# EasyEDA schematic SCH_Tanbre_v2_latest.json
TITLE: Tanbre; REV: 2.0; Date: 2026-05-30; Sheet: 1/1; Company: Student
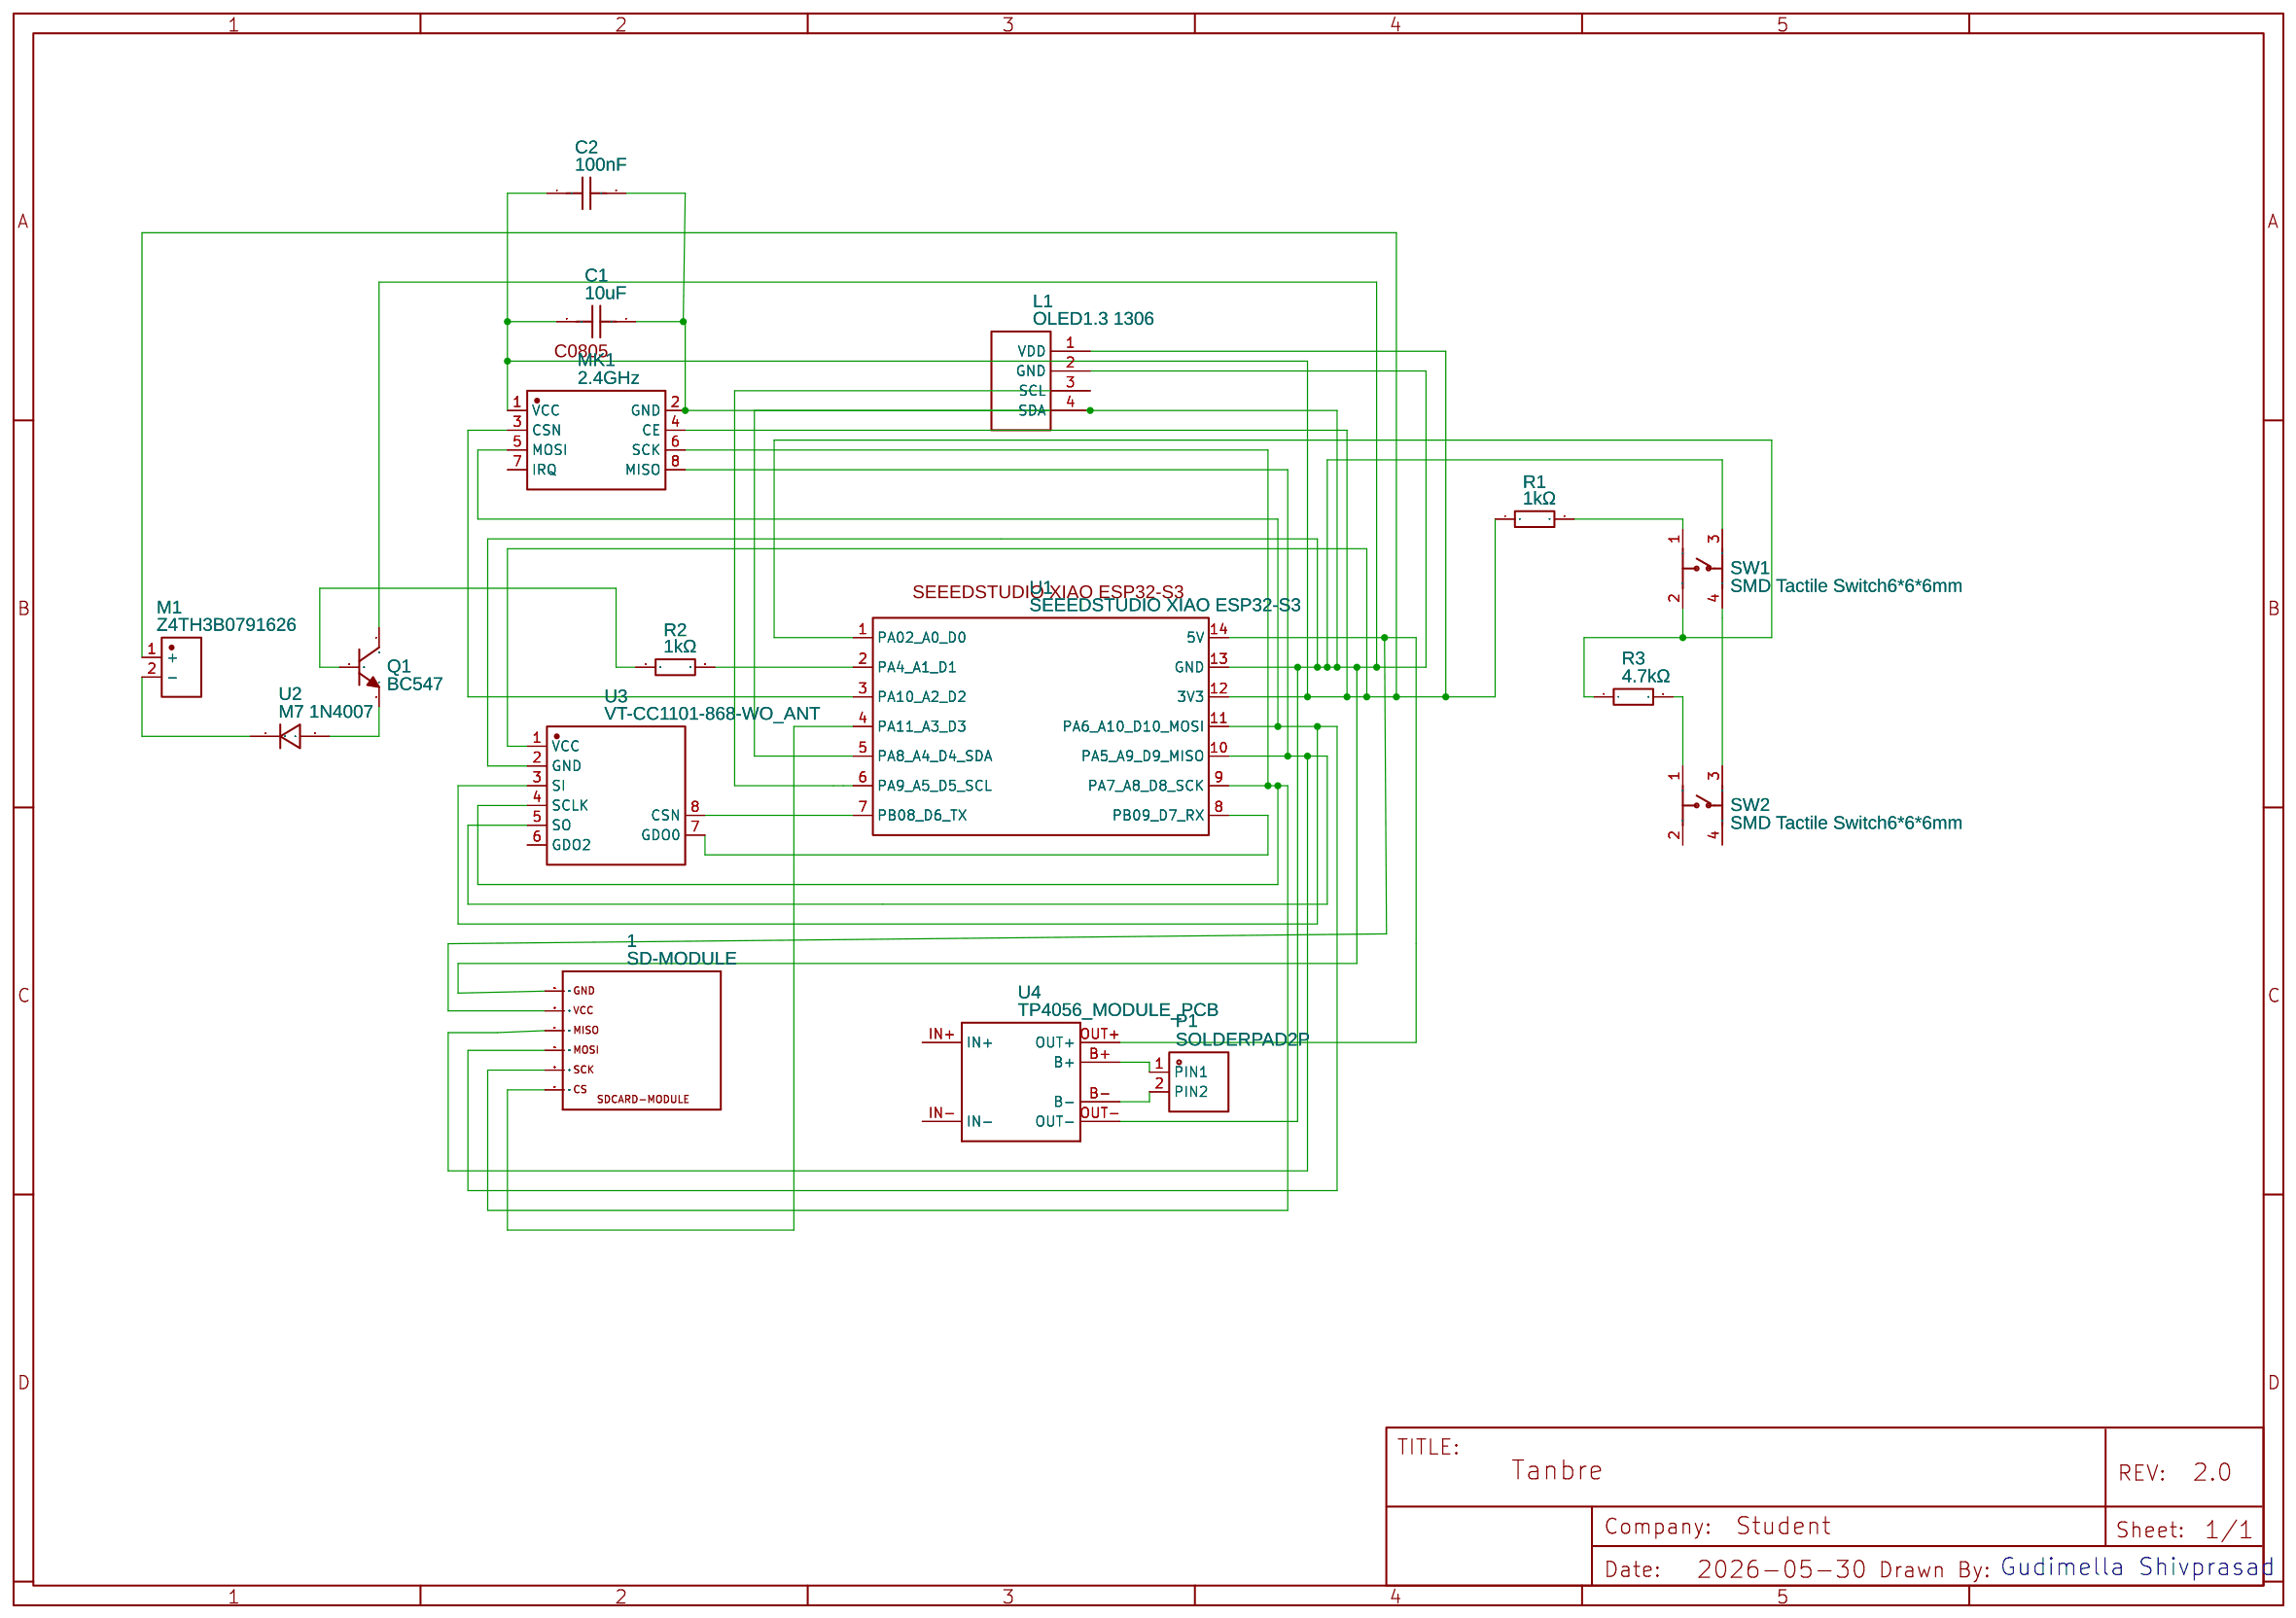
[diagram p0: schematic sheet]

## Parts
1  SD-MODULE  [MICROSD_MODULE]
C1  10uF  [C0805]
C2  100nF  [C0805]
L1  OLED1.3 1306  [OLED 1306-1.3INCH-I2C]
M1  Z4TH3B0791626  [MOTOR-SMD_Z4TH3B0791626]
MK1  2.4GHz  [WIRELM-SMD_L28.6-W15.3-P2.54_NRF24L01]
P1  SOLDERPAD2P  [SOLDERPAD-BIG-2X1-2.54MM]
Q1  BC547  [TO-92-3_L4.5-W3.5-P1.27-L]
R1  1kΩ  [R0402]
R2  1kΩ  [R0402]
R3  4.7kΩ  [R1206]
SW1  SMD Tactile Switch6*6*6mm  [SW-SMD_4P-L6.0-W6.0-P4.50-LS9.0_C23873]
SW2  SMD Tactile Switch6*6*6mm  [SW-SMD_4P-L6.0-W6.0-P4.50-LS9.0_C23873]
U1  SEEEDSTUDIO XIAO ESP32-S3  [AXIAO-ESP32S3-SMD-V2.2]
U2  M7 1N4007  [SMA_L4.4-W2.8-LS5.4-RD]
U3  VT-CC1101-868-WO_ANT  [WIRELM-SMD_VT-CC1101-433]
U4  TP4056_MODULE_PCB  [TP4056-LITHIUM-PROTECTED-MODULE]

## Library data of the parts
1 = SD-MODULE: Contributor: motysolo
C1 = V106K0805X5R250NHP: Contributor: lcsc; Supplier: LCSC; Supplier Part: C5240379; Manufacturer: VIIYONG(微容); JLCPCB Part Class: Extended Part; Package Display: Yes
C2 = VJ0805Y104KXXCW1BC: Supplier: LCSC; Supplier Part: C2169829; Manufacturer: VISHAY(威世); JLCPCB Part Class: Extended Part; Contributor: lcsc
L1 = OLED1.3 1306: Contributor: pitbulacc
M1 = Z4TH3B0791626: Supplier: LCSC; Supplier Part: C2836756; Manufacturer: KOTL(金龙机电); JLCPCB Part Class: Extended Part; Contributor: lcsc
MK1 = NRF24L01: Supplier: LCSC; Manufacturer: Ai-Thinker(安信可); Manufacturer Part: NF-04; Supplier Part: C90751; JLCPCB Part Class: Extended Part
P1 = SOLDERPAD2P: Manufacturer Part: New SchematicLib; Contributor: bszabo
Q1 = BC547: Contributor: LCSC; Supplier: LCSC; Supplier Part: C2910381; Manufacturer: CJ(江苏长电/长晶); Manufacturer Part: BC547(RANGE:420-800); JLCPCB Part Class: Extended Part
R1 R2 = CR-02JL6----1K: Contributor: LCSC; Supplier: LCSC; Supplier Part: C279987; Manufacturer: Viking(光颉); JLCPCB Part Class: Extended Part
R3 = RMC12064.7K5%N: Contributor: LCSC; Supplier: LCSC; Supplier Part: C269760; Manufacturer: Tyohm(幸亚电阻); JLCPCB Part Class: Extended Part
SW1 SW2 = SMD Tactile Switch6*6*6mm: Supplier Part: C23873; Supplier: LCSC; Manufacturer: null; Manufacturer Part: 贴片轻触开关6*6*6mm; JLCPCB Part Class: Extended Part
U1 = SEEEDSTUDIO XIAO ESP32-S3: Contributor: claudiu2001
U2 = M7 1N4007: Contributor: lcsc; Supplier: LCSC; Supplier Part: C5337558; Manufacturer: JUXING(钜兴); JLCPCB Part Class: Extended Part
U3 = VT-CC1101-868-WO_ANT: Supplier: LCSC; Supplier Part: C781538; Manufacturer: VCHIP; Manufacturer Part: VT-CC1101-433; Contributor: LCSC; JLCPCB Part Class: Extended Part
U4 = TP4056_MODULE_PCB: null

## Nets
Net-(1-P$1): 1.P$1 U1.4(PA11_A3_D3)
Net-(1-P$2): 1.P$2 MK1.6(SCK) U1.9(PA7_A8_D8_SCK) U3.4(SCLK)
Net-(1-P$3): 1.P$3 MK1.5(MOSI) U1.11(PA6_A10_D10_MOSI) U3.3(SI)
Net-(1-P$4): 1.P$4 MK1.8(MISO) U1.10(PA5_A9_D9_MISO) U3.5(SO)
Net-(1-P$5): 1.P$5 U1.14(5V) U4.OUT+
Net-(1-P$6): 1.P$6 C1.2 C2.2 L1.2(GND) L1.4(SDA) MK1.2(GND) Q1.1(C) SW1.3 U1.5(PA8_A4_D4_SDA) U1.13(GND) U3.2(GND) U4.OUT-
Net-(C1-1): C1.1 C2.1 L1.1(VDD) M1.1(+) MK1.1(VCC) MK1.4(CE) R1.1 U1.12(3V3) U3.1(VCC)
Net-(L1-3): L1.3(SCL) U1.6(PA9_A5_D5_SCL)
Net-(M1-2): M1.2(-) U2.1
Net-(MK1-3): MK1.3(CSN) U1.3(PA10_A2_D2)
Net-(P1-1): P1.1(PIN1) U4.B+
Net-(P1-2): P1.2(PIN2) U4.B-
Net-(Q1-2): Q1.2(B) R2.1
Net-(Q1-3): Q1.3(E) U2.2
Net-(R1-2): R1.2 SW1.1
Net-(R2-2): R2.2 U1.2(PA4_A1_D1)
Net-(R3-1): R3.1 SW1.2 U1.1(PA02_A0_D0)
Net-(R3-2): R3.2 SW2.1
Net-(SW1-4): SW1.4 SW2.3
Net-(U1-7): U1.7(PB08_D6_TX) U3.8(CSN)
Net-(U1-8): U1.8(PB09_D7_RX) U3.7(GDO0)

Not connected (* = marked no-connect by the designer): MK1 7(IRQ); SW2 2 4; U3 6(GDO2); U4 IN+ IN-

## Notes on the sheet
- Gudimella Shivprasad
